# EAGLE design shrimpv1 (EAGLE 5.12)
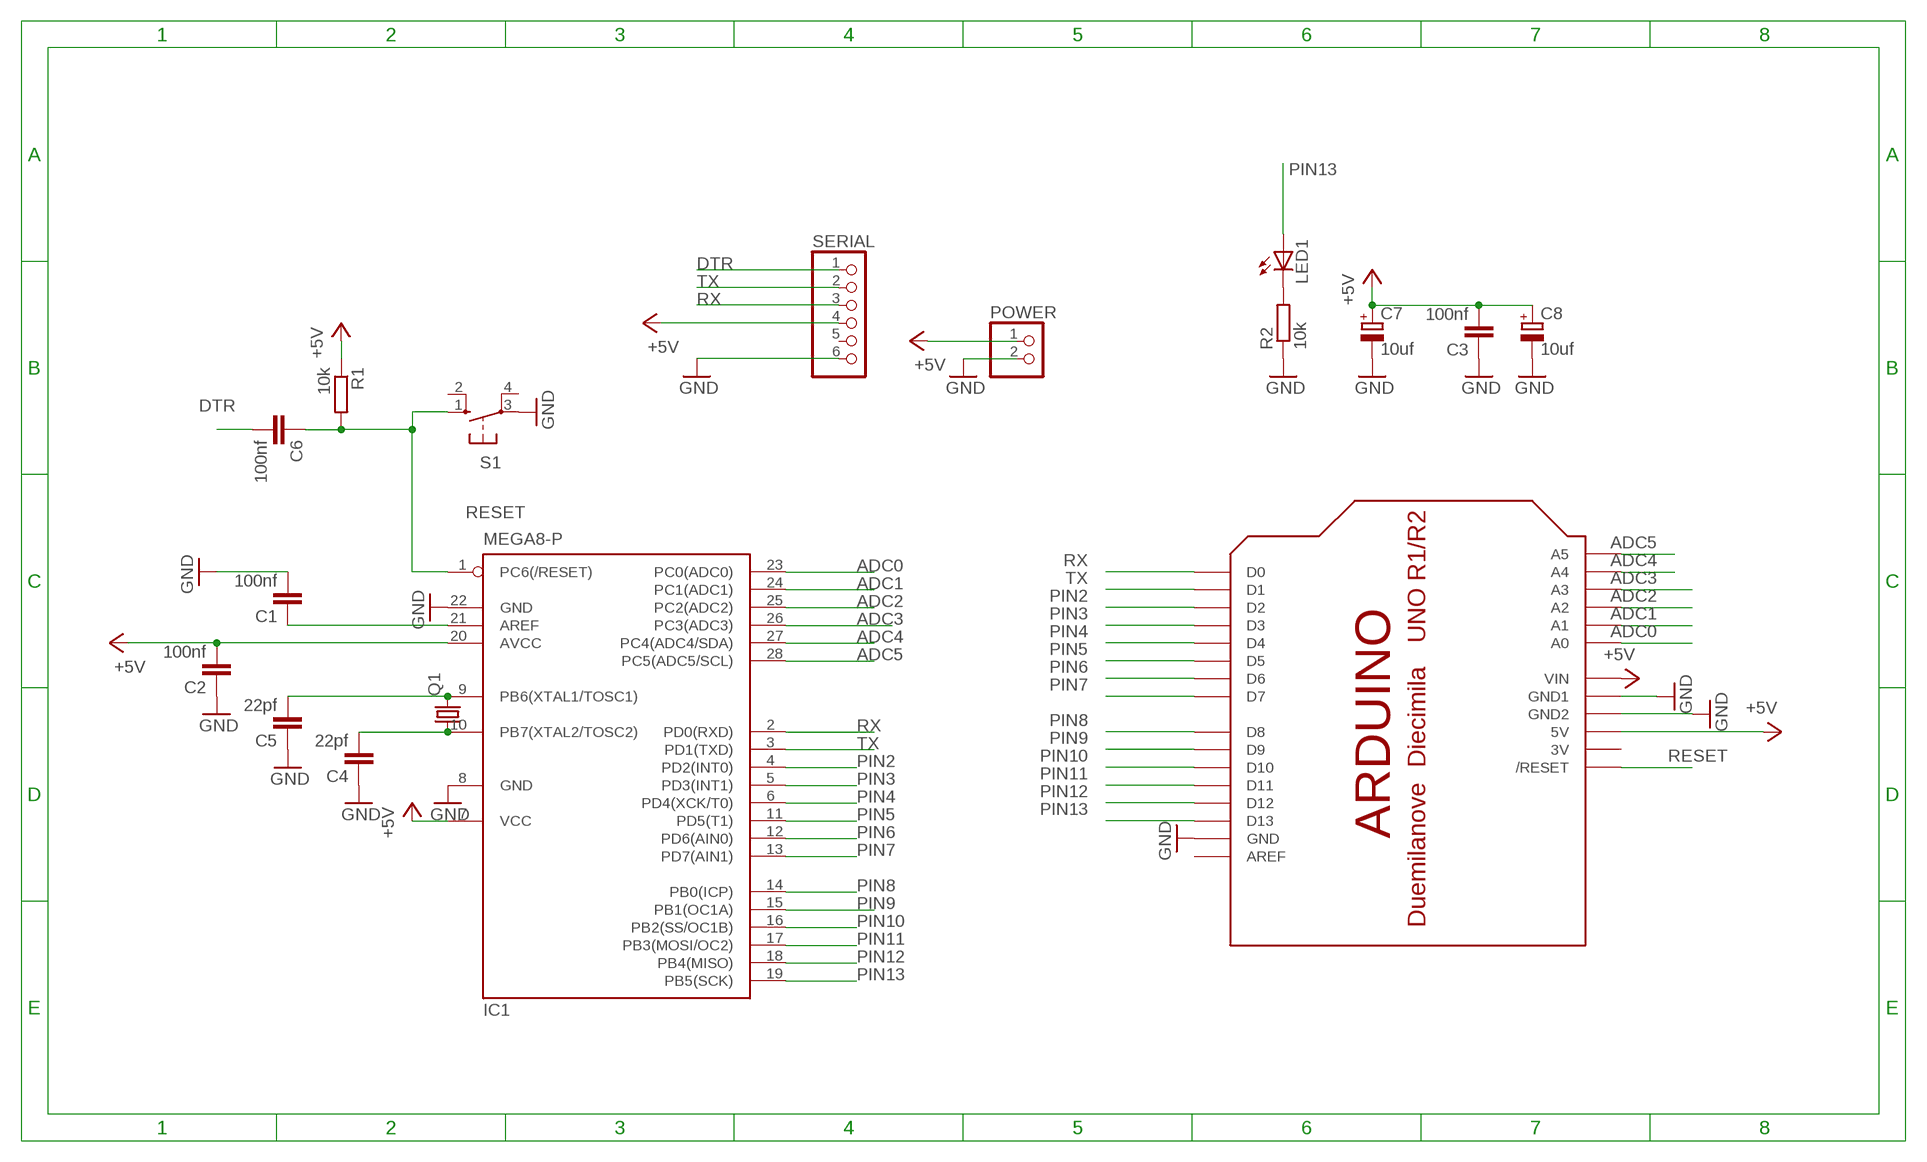
[diagram p0: schematic, sheet 1]

## Parts
C1  100nf  C-EU025-025X050  [C025-025X050]
C2  100nf  C-EU025-025X050  [C025-025X050]
C3  100nf  C-EU025-025X050  [C025-025X050]
C4  22pf  C-EU025-025X050  [C025-025X050]
C5  22pf  C-EU025-025X050  [C025-025X050]
C6  100nf  C-EU025-025X050  [C025-025X050]
C7  10uf  CPOL-EUE2,5-6E  [E2,5-6E]
C8  10uf  CPOL-EUE2,5-6E  [E2,5-6E]
IC1  MEGA8-P  [DIL28-3]
LED1  LED5MM  [LED5MM]
POWER  PINHD-1X2  [1X02]
Q1  CRYSTALHC49U70  [HC49U70]
R1  10k  R-EU_0204/7  [0204/7]
R2  10k  R-EU_0204/7  [0204/7]
S1  10-XX  [B3F-10XX]
SERIAL  PINHD-1X6  [1X06]
U$1  ARDUINOUNO  [ARDUINO]

## Nets
+5V: C2.2 C3.2 C7.+ C8.+ IC1.7(VCC) IC1.20(AVCC) POWER.1 R1.1 SERIAL.4 U$1.5V U$1.VIN
ADC0: IC1.23(PC0(ADC0)) U$1.A0
ADC1: IC1.24(PC1(ADC1)) U$1.A1
ADC2: IC1.25(PC2(ADC2)) U$1.A2
ADC3: IC1.26(PC3(ADC3)) U$1.A3
ADC4: IC1.27(PC4(ADC4/SDA)) U$1.A4
ADC5: IC1.28(PC5(ADC5/SCL)) U$1.A5
DTR: C6.2 SERIAL.1
GND: C1.2 C2.1 C3.1 C4.1 C5.1 C7.- C8.- IC1.8(GND) IC1.22(GND) POWER.2 R2.1 S1.3(P) SERIAL.6 U$1.GND U$1.GND1 U$1.GND2
N$1: C1.1 IC1.21(AREF)
N$4: C5.2 IC1.9(PB6(XTAL1/TOSC1)) Q1.2
N$5: C4.2 IC1.10(PB7(XTAL2/TOSC2)) Q1.1
N$22: LED1.K(C) R2.2
PIN2: IC1.4(PD2(INT0)) U$1.D2
PIN3: IC1.5(PD3(INT1)) U$1.D3
PIN4: IC1.6(PD4(XCK/T0)) U$1.D4
PIN5: IC1.11(PD5(T1)) U$1.D5
PIN6: IC1.12(PD6(AIN0)) U$1.D6
PIN7: IC1.13(PD7(AIN1)) U$1.D7
PIN8: IC1.14(PB0(ICP)) U$1.D8
PIN9: IC1.15(PB1(OC1A)) U$1.D9
PIN10: IC1.16(PB2(SS/OC1B)) U$1.D10
PIN11: IC1.17(PB3(MOSI/OC2)) U$1.D11
PIN12: IC1.18(PB4(MISO)) U$1.D12
PIN13: IC1.19(PB5(SCK)) LED1.A U$1.D13
RESET: C6.1 IC1.1(PC6(/RESET)) R1.2 S1.1(S) U$1.RESET(/RESET)
RX: IC1.2(PD0(RXD)) SERIAL.3 U$1.D0
TX: IC1.3(PD1(TXD)) SERIAL.2 U$1.D1
Unconnected: S1.2(S1) S1.4(P1) SERIAL.5 U$1.AREF

## Power pins joined to a net without a drawn wire
3V: U$1.3V

## Library data of the parts
C1-C6 = rcl:C-EU: CAPACITOR, European symbol
C7 C8 = matt rcl:CPOL-EU: POLARIZED CAPACITOR, European symbol
IC1 = atmel:MEGA8-P: MICROCONTROLLER 8 Kbytes FLASH, 1 kbytes SRAM, 512 bytes EEPROM, USART, 4-channel 10 bit ADC, 2-channel 8 bit ADC Pin compatible with Atmega48, ATMega88, ATMega168 Source: avr.lbr; OC_FARNELL: unknown; OC_NEWARK: unknown
LED1 = led:LED: LED OSRAM: - CHIPLED LG R971, LG N971, LY N971, LG Q971, LY Q971, LO R971, LY R971 LH N974, LH R974 LS Q976, LO Q976, LY Q976 LO Q996 - Hyper CHIPLED LW Q18S LB Q993, LB Q99A, LB R99A - SideLED LS A670, LO A670, LY A670, LG A670, LP A670 LB A673, LV A673, LT A673, LW A673 LH A674 LY A675 LS A676, LA A676, LO A676, LY A676, LW A676 LS A679, LY A679, LG A679 - Hyper Micro SIDELED® LS Y876, LA Y876, LO Y876, LY Y876 LT Y87S - SmartLED LW L88C, LW L88S LB L89C, LB L89S, LG L890 LS L89K, LO L89K, LY L89K LS L896, LA L896, LO L896, LY L896 - TOPLED LS T670, LO T670, LY T670, LG T670, LP T670 LSG T670, LSP T670, LSY T670, LOP T670, LYG T670 LG T671, LOG T671, LSG T671 LB T673, LV T673, LT T673, LW T673 LH T674 LS T676, LA T676, LO T676, LY T676, LB T676, LH T676, LSB T676, LW T676 LB T67C, LV T67C, LT T67C, LS T67K, LO T67K, LY T67K, LW E67C LS E67B, LA E67B, LO E67B, LY E67B, LB E67C, LV E67C, LT E67C LW T67C LS T679, LY T679, LG T679 LS T770, LO T770, LY T770, LG T770, LP T770 LB T773, LV T773, LT T773, LW T773 LH T774 LS E675, LA E675, LY E675, LS T675 LS T776, LA T776, LO T776, LY T776, LB T776 LHGB T686 LT T68C, LB T68C - Hyper Mini TOPLED® LB M676 - Mini TOPLED Santana® LG M470 LS M47K, LO M47K, LY M47K Source: http://www.osram.convergy.de LUXEON: - LUMILED® LXK2-PW12-R00, LXK2-PW12-S00, LXK2-PW14-U00, LXK2-PW14-V00 LXK2-PM12-R00, LXK2-PM12-S00, LXK2-PM14-U00 LXK2-PE12-Q00, LXK2-PE12-R00, LXK2-PE12-S00, LXK2-PE14-T00, LXK2-PE14-U00 LXK2-PB12-K00, LXK2-PB12-L00, LXK2-PB12-M00, LXK2-PB14-N00, LXK2-PB14-P00, LXK2-PB14-Q00 LXK2-PR12-L00, LXK2-PR12-M00, LXK2-PR14-Q00, LXK2-PR14-R00 LXK2-PD12-Q00, LXK2-PD12-R00, LXK2-PD12-S00 LXK2-PH12-R00, LXK2-PH12-S00 LXK2-PL12-P00, LXK2-PL12-Q00, LXK2-PL12-R00 Source: www.luxeon.com KINGBRIGHT: KA-3528ASYC Source: www.kingbright.com
POWER = pinhead:PINHD-1X2: PIN HEADER
Q1 = crystal:CRYSTAL: CRYSTAL; OC_FARNELL: unknown; OC_NEWARK: unknown
R1 R2 = resistor:R-EU_: RESISTOR, European symbol
S1 = switch-omron:10-XX: OMRON SWITCH; MPN: B3F-1000; OC_FARNELL: 176432; OC_NEWARK: 36M3542
SERIAL = pinhead:PINHD-1X6: PIN HEADER
U$1 = adafruit:ARDUINO: Arduino Diecimila/Duemilanove Make a shield with ease, this package has all the named pins as well as the two mounting drill holes and an outline of the USB and DC power connector. The outline is on the DIMENSION layer, so if your board house uses it they will cut the outline to match. http://www.ladyada.net/library/pcb/eaglelibrary.html

## Net classes
0 default: width 0.4 mm

## Board
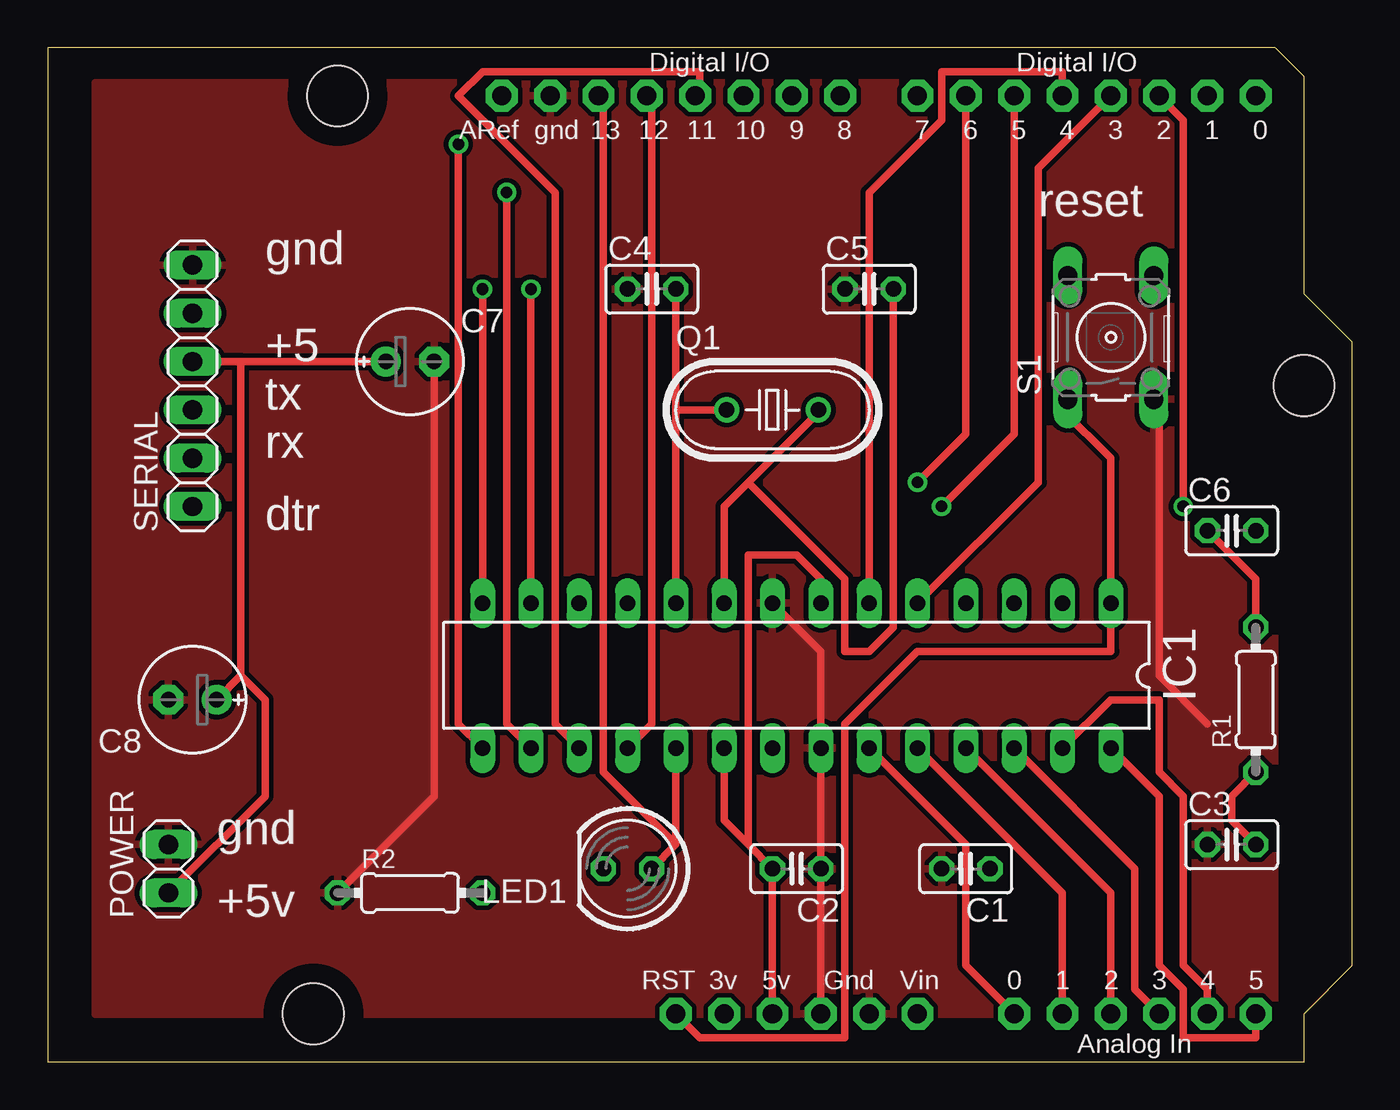
[diagram p1: board, top side]
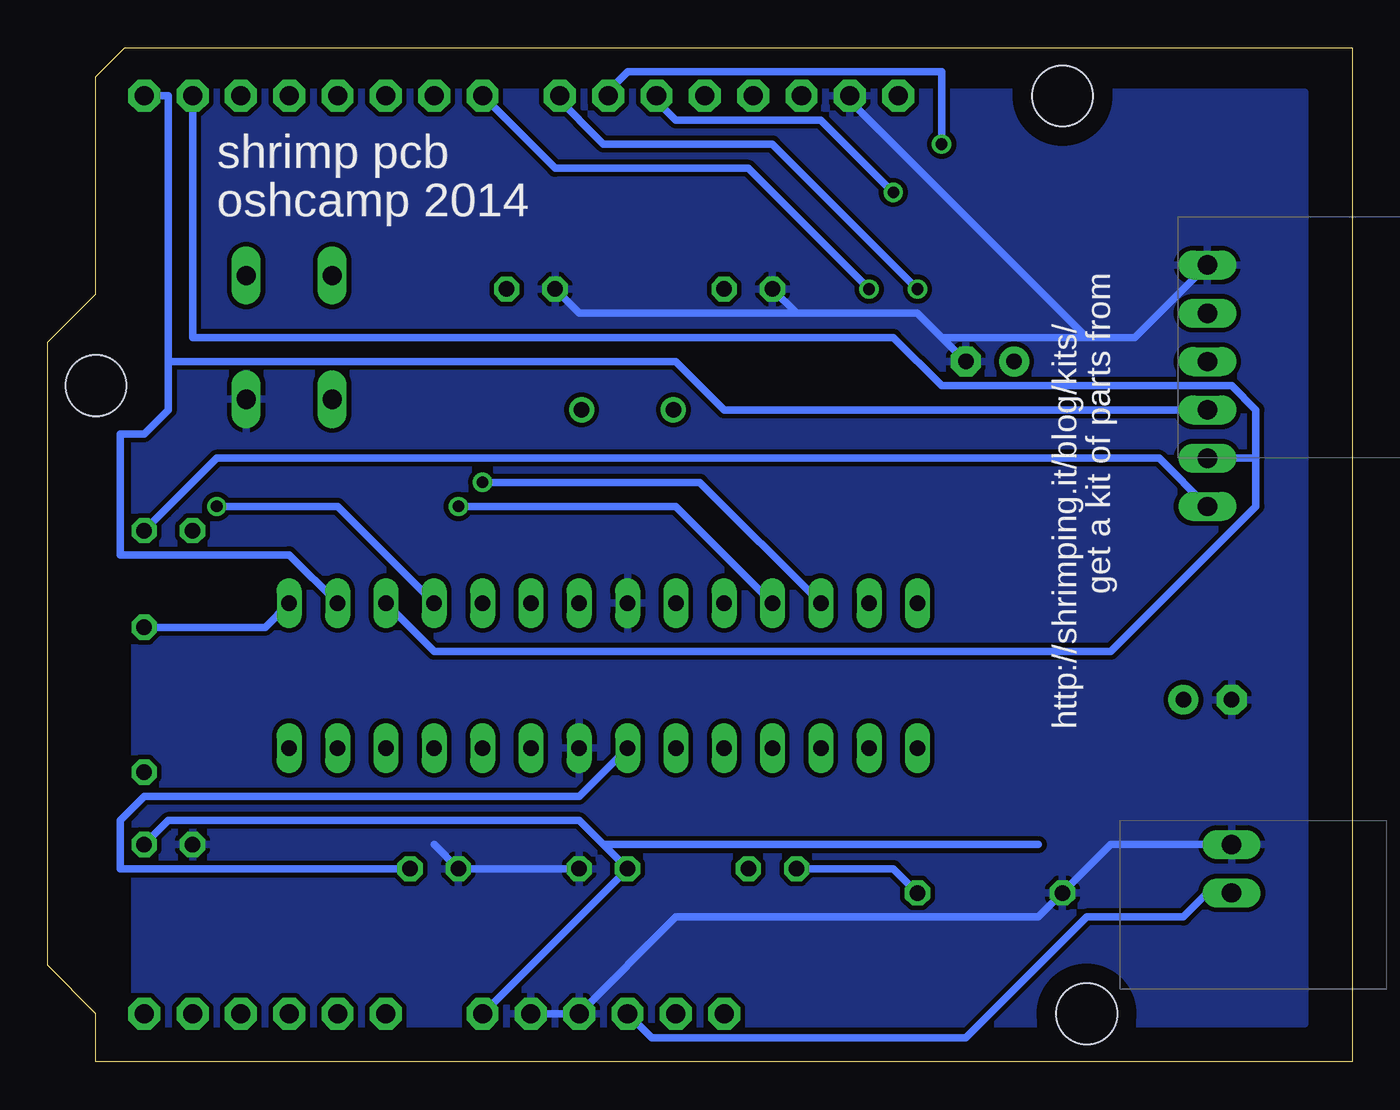
[diagram p2: board, bottom side, seen from below]

Size 68.58 x 53.34 mm. Coordinates in mm from the lower left corner, seen from the top.
Copper layers (1*16): Top 0.035mm / dielectric 1.5mm / Bottom 0.035mm
Design rules "default": minimum track width 10mil, minimum drill 24mil, track to track 8mil, track to pad 8mil, pad to pad 8mil, via to via 8mil, smd to smd 8mil, copper to edge 40mil, drill to drill 8mil, minimum pad ring 10mil, minimum via ring 8mil, stop-mask expansion 4mil, vias tented up to drill 0mil, thermal gap 10mil

### Footprints (pad centres in the part's own frame; a part is rotated, then mirrored left to right if it is on the bottom)
C025-025X050 = drill 0.813 octagon: 1 -1.27,0; 2 1.27,0
E2,5-6E = drill 0.813 pad 1.575 round: + -1.27,0 | drill 0.813 pad 1.575 octagon: - 1.27,0
DIL28-3 = drill 0.813 long: 1 -16.51,-3.81; 2 -13.97,-3.81; 3 -11.43,-3.81; 4 -8.89,-3.81; 5 -6.35,-3.81; 6 -3.81,-3.81; 7 -1.27,-3.81; 8 1.27,-3.81; 9 3.81,-3.81; 10 6.35,-3.81; 11 8.89,-3.81; 12 11.43,-3.81; 13 13.97,-3.81; 14 16.51,-3.81; 15 16.51,3.81; 16 13.97,3.81; 17 11.43,3.81; 18 8.89,3.81; 19 6.35,3.81; 20 3.81,3.81; 21 1.27,3.81; 22 -1.27,3.81; 23 -3.81,3.81; 24 -6.35,3.81; 25 -8.89,3.81; 26 -11.43,3.81; 27 -13.97,3.81; 28 -16.51,3.81
LED5MM = drill 0.813 octagon: A -1.27,0; K 1.27,0
1X02 = drill 1.016 long: 1 -1.27,0; 2 1.27,0
HC49U70 = drill 0.813 round: 1 -2.413,0; 2 2.413,0
0204/7 = drill 0.813 octagon: 1 -3.81,0; 2 3.81,0
B3F-10XX = drill 1.016 long: 1 -3.251,2.261; 2 3.251,2.261; 3 -3.251,-2.261; 4 3.251,-2.261
1X06 = drill 1.016 long: 1 -6.35,0; 2 -3.81,0; 3 -1.27,0; 4 1.27,0; 5 3.81,0; 6 6.35,0
ARDUINO = drill 1 pad 1.676 octagon: 3V 35.56,2.54; 5V 38.1,2.54; A0 50.8,2.54; A1 53.34,2.54; A2 55.88,2.54; A3 58.42,2.54; A4 60.96,2.54; A5 63.5,2.54; AREF 23.876,50.8; D0 63.5,50.8; D1 60.96,50.8; D2 58.42,50.8; D3 55.88,50.8; D4 53.34,50.8; D5 50.8,50.8; D6 48.26,50.8; D7 45.72,50.8; D8 41.656,50.8; D9 39.116,50.8; D10 36.576,50.8; D11 34.036,50.8; D12 31.496,50.8; D13 28.956,50.8; GND 26.416,50.8; GND1 43.18,2.54; GND2 40.64,2.54; RESET 33.02,2.54; VIN 45.72,2.54 | hole 3.2: 15.24,50.8; 66.04,35.56; 13.97,2.54

### Placement (x,y rotation side)
C1  48.26,10.16 180 top
C2  39.37,10.16 180 top
C3  62.23,11.43 0 top
C4  31.75,40.64 0 top
C5  43.18,40.64 0 top
C6  62.23,27.94 0 top
C7  19.05,36.83 0 top
C8  7.62,19.05 180 top
IC1  39.37,20.32 180 top
LED1  30.48,10.16 180 top
POWER  6.35,10.16 90 top
Q1  38.1,34.29 0 top
R1  63.5,19.05 90 top
R2  19.05,8.89 0 top
S1  55.88,38.1 90 top
SERIAL  7.62,35.56 90 top
U$1  0,0 0 top
U$2  [OPENHWLOGO300DPI]  59.69,6.35 0 bottom

### Tracks (layer width: path | path; a pad name or v marks a point on that pad's centre or on a via)
+5V
  Top 0.4: 10.16,36.83 C7.+ | 10.16,36.83 SERIAL.4 | 10.16,20.32 10.16,36.83 | 36.83,11.43 35.56,12.7 IC1.20 | 36.83,11.43 C2.2 U$1.5V | 36.83,11.43 36.83,26.67 39.37,26.67 40.64,25.4 IC1.7 | 10.16,20.32 C8.+ | R1.1 62.23,13.97 62.23,12.7 C3.2 | 10.16,20.32 11.43,19.05 11.43,13.97 POWER.1
  Bottom 0.4: U$1.VIN C2.2 39.37,11.43 | 39.37,11.43 40.64,12.7 62.23,12.7 C3.2 | 39.37,11.43 16.51,11.43 | U$1.5V 36.83,1.27 20.32,1.27 13.97,7.62 8.89,7.62 7.62,8.89 POWER.1
ADC0
  Top 0.4: IC1.23 48.26,11.43 48.26,5.08 U$1.A0
ADC1
  Top 0.4: IC1.24 53.34,8.89 U$1.A1
ADC2
  Top 0.4: IC1.25 55.88,8.89 U$1.A2
ADC3
  Top 0.4: IC1.26 57.15,10.16 57.15,3.81 U$1.A3
ADC4
  Top 0.4: IC1.27 55.88,19.05 58.42,19.05 58.42,15.24 59.69,13.97 59.69,5.08 60.96,3.81 U$1.A4
ADC5
  Top 0.4: IC1.28 58.42,13.97 58.42,5.08 59.69,3.81 59.69,1.27 63.5,1.27 U$1.A5
DTR
  Bottom 0.4: C6.2 59.69,31.75 10.16,31.75 SERIAL.1
GND
  Top 0.4: IC1.8 40.64,21.59 IC1.22 C2.1 U$1.GND2 | 60.96,17.78 58.42,20.32 58.42,34.29 S1.3 | R2.1 20.32,13.97 C7.-
  Bottom 0.4: U$1.GND1 U$1.GND2 35.56,7.62 16.51,7.62 R2.1 12.7,11.43 POWER.2 | C2.1 C1.2 48.26,11.43 | 29.21,39.37 C4.1 | 29.21,39.37 22.86,39.37 21.59,38.1 | C7.- 21.59,38.1 | C5.1 40.64,39.37 29.21,39.37 | SERIAL.6 11.43,38.1 13.97,38.1 | 21.59,38.1 13.97,38.1 | 13.97,38.1 26.67,50.8 U$1.GND
  pour Top (isolate 0.25): 3,51.5 64.5,51.5 64.5,2.5 2.5,2.5 2.5,51.5
  pour Bottom (isolate 0.25): 2.5,51 64,51 64,2 2.5,2
N$1
  Bottom 0.4: IC1.21 40.64,13.97 63.5,13.97 64.77,12.7 64.77,10.16 C1.1
N$4
  Top 0.4: IC1.9 35.56,29.21 36.83,30.48 | 36.83,30.48 40.64,34.29 Q1.2 | C5.2 44.45,22.86 43.18,21.59 41.91,21.59 41.91,25.4 36.83,30.48
N$5
  Top 0.4: 33.02,34.29 C4.2 | IC1.10 33.02,34.29 | 33.02,34.29 Q1.1
N$22
  Bottom 0.4: R2.2 24.13,10.16 LED1.K
PIN2  (via drill 0.61)
  Top 0.4: v59.69,29.21 59.69,49.53 U$1.D2
  Bottom 0.4: IC1.4 53.34,29.21 v59.69,29.21
PIN3
  Top 0.4: IC1.5 52.07,30.48 52.07,46.99 U$1.D3
PIN4
  Top 0.4: IC1.6 43.18,45.72 46.99,49.53 46.99,52.07 53.34,52.07 U$1.D4
PIN5  (via drill 0.61)
  Top 0.4: v46.99,29.21 50.8,33.02 U$1.D5
  Bottom 0.4: IC1.11 35.56,29.21 v46.99,29.21
PIN6  (via drill 0.61)
  Top 0.4: v45.72,30.48 48.26,33.02 U$1.D6
  Bottom 0.4: IC1.12 34.29,30.48 v45.72,30.48
PIN7  (via drill 0.61)
  Top 0.4: IC1.13 v25.4,40.64
  Bottom 0.4: v25.4,40.64 31.75,46.99 41.91,46.99 U$1.D7
PIN8  (via drill 0.61)
  Top 0.4: IC1.14 v22.86,40.64
  Bottom 0.4: v22.86,40.64 30.48,48.26 39.37,48.26 41.91,50.8 U$1.D8
PIN9  (via drill 0.61)
  Top 0.4: IC1.15 21.59,17.78 v21.59,48.26
  Bottom 0.4: v21.59,48.26 21.59,52.07 38.1,52.07 39.37,50.8 U$1.D9
PIN10  (via drill 0.61)
  Top 0.4: IC1.16 24.13,17.78 v24.13,45.72
  Bottom 0.4: v24.13,45.72 27.94,49.53 35.56,49.53 36.83,50.8 U$1.D10
PIN11
  Top 0.4: IC1.17 26.67,17.78 26.67,45.72 21.59,50.8 22.86,52.07 34.29,52.07 34.29,50.8 U$1.D11
PIN12
  Top 0.4: IC1.18 31.75,17.78 31.75,50.8 U$1.D12
PIN13
  Top 0.4: LED1.A 33.02,11.43 | 33.02,11.43 IC1.19 | 33.02,11.43 29.21,15.24 29.21,50.8 U$1.D13
RESET
  Top 0.4: C6.1 63.5,25.4 R1.2 | S1.1 53.34,34.29 55.88,31.75 IC1.1 55.88,21.59 45.72,21.59 41.91,17.78 41.91,1.27 34.29,1.27 U$1.RESET
  Bottom 0.4: IC1.1 57.15,22.86 R1.2
RX
  Bottom 0.4: IC1.2 55.88,26.67 64.77,26.67 64.77,33.02 63.5,33.02 62.23,34.29 62.23,36.83 | 62.23,36.83 62.23,50.8 U$1.D0 | SERIAL.3 33.02,34.29 35.56,36.83 62.23,36.83
TX
  Bottom 0.4: IC1.3 48.26,21.59 12.7,21.59 5.08,29.21 5.08,31.75 | 5.08,31.75 SERIAL.2 | U$1.D1 60.96,38.1 24.13,38.1 21.59,35.56 6.35,35.56 5.08,34.29 5.08,31.75

### Text on the board
tNames: reset | gnd | +5 | tx | rx | dtr | gnd | +5v
bNames: shrimp pcb | oshcamp 2014 | get a kit of parts from | http://shrimping.it/blog/kits/